# Altium schematic sheet Power.SchDoc
size A4; SheetNumber: 2; SheetTotal: 6
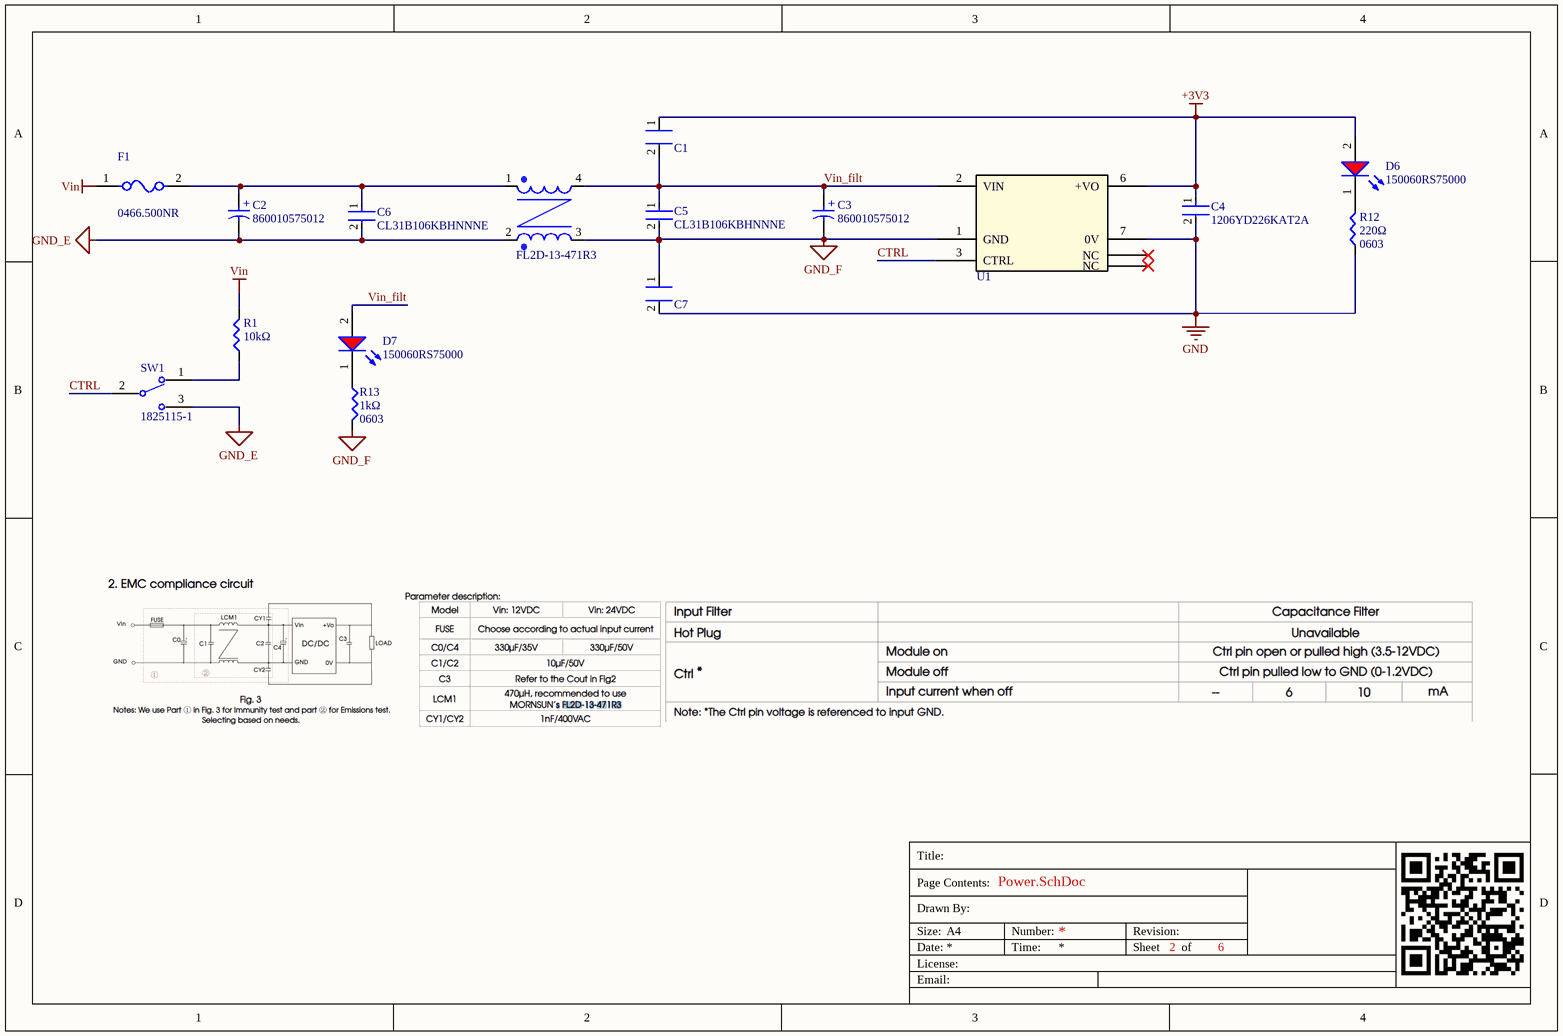
[diagram p0: Power.SchDoc]

## Parts
C1  1nf 400V AC 7.5mm Lead  [PCBComponent_1]  (value not drawn)
C2  860010575012  [WCAP-ATG8_D10H12.5]
C3  860010575012  [WCAP-ATG8_D10H12.5]
C4  1206YD226KAT2A  [FP-1206-L_3_2_0_2-W_1_6_0-IPC_A]
C5  CL31B106KBHNNNE  [FP-CL31B106KBHNNNE-IPC_A]
C6  CL31B106KBHNNNE  [FP-CL31B106KBHNNNE-IPC_A]
C7  1nf 400V AC 7.5mm Lead  [PCBComponent_1]  (value not drawn)
D6  150060RS75000  [WL-SMCW_0603_150060xx75000]
D7  150060RS75000  [WL-SMCW_0603_150060xx75000]
F1  0466.500NR  [FP-0466-MFG]
FL2D-13-471R3  EMC Filte  [FL2D-13-471R3]  (value not drawn)
R1  value 10kΩ  [0603-smd]  (hidden comment: 0603_10K)
R12  value 220Ω  Package: 0603  [0603-smd]  (hidden comment: 0603_220R)
R13  value 1kΩ  Package: 0603  [0603-smd]  (hidden comment: 0603_1K)
SW1  1825115-1  [FP-1825115-1-MFG]
U1  DC DC CONVERTER 3.3V 6W  [VRB_S-6WR3_MNS]  (value not drawn)

## Nets
+3V3: C1.1 C4.1 D6.2(A) U1.6(+VO)
GND: C4.2 C7.2 R12.1 U1.7(0V)
GND_E: C2.2(N) C6.2 FL2D-13-471R3.2 SW1.3
GND_F: C3.2(N) C5.2 C7.1 FL2D-13-471R3.3 R13.2 U1.1(GND)
Vin: F1.1 R1.2
CTRL: SW1.2 U1.3(CTRL)
Vin_filt: C1.2 C3.1(P) C5.1 D7.2(A) FL2D-13-471R3.4 U1.2(VIN)
NetC2_1: C2.1(P) C6.1 F1.2 FL2D-13-471R3.1
NetD6_1: D6.1(K) R12.2
NetD7_1: D7.1(K) R13.1
NetR1_1: R1.1 SW1.1

Not connected (* = marked no-connect by the designer): U1 5(NC)* 8(NC)*

## Notes on the sheet
- Title:
- Drawn By:
- Page Contents:
- Size:
- Date:
- License:
- Email:
- A4
- Number:
- Time:
- Revision:
- Sheet
- of
- (in symbol CMP-03913-54007241-1) +

## Library data of the parts
C1 C7 = C717U102MYVDBA7317: Suppression Cap, 1000Pf, Class X1/ Y2 Rohs Compliant: Yes |Kemet C717U102MYVDBA7317; Manufacturer: KEMET; Supplier 1: Mouser; Manufacturer Part Number: C717U102MYVDBA7317; RoHS: Yes; Category: Ceramic Capacitors; Stock 1: 1838; Pricing 1: 1=0,72, 10=0,387, 50=0,387, 100=0,25, 1000=0,223, 10000=0,18 (USD); RoHS Compliant: Yes; Supplier Part Number 1: 80-C717U102MYVDB7317; ComponentLink1Description: Datasheet; ComponentLink1URL: https://content.kemet.com/datasheets/KEM_C1103_KJY.pdf
C2 C3 = CMP-03913-54007241-1: 860010575012 WCAP-ATG8 Aluminum Electrolytic Capacitors; Ripple Current: 528mA; Voltage Rating: 35V; Capacitance: 330µF; Pitch: 5mm; Tolerance: 20%; Leakage Current: 115.5µA; Life (Hours): 2000hours; Case/Package: Radial; Max Operating Temperature: 85°C; REACH SVHC: Unknown; Min Operating Temperature: -40°C; NexarPartId: 54007241; Lead Pitch: 5mm; RoHS: Non-Compliant; Voltage Rating (DC): 35V; Diameter: 10mm; Height: 12.5mm; Length: 12.5mm
C4 = CMP-1037-04992-2: General Purpose Ceramic Capacitor, 1206, 22uF, 10%, X5R, 15%, 16V; REACH SVHC: No SVHC; Height: 0.07mm; Lead Free: Lead Free; Voltage Rating: 16V; Width: 0.063inch; Voltage Rating (DC): 16V; Mount: Surface Mount; Capacitance: 22uF; Case Code (Imperial): 1206; Package Quantity: 1; Radiation Hardening: No; Packaging: Tape and Reel; Number of Pins: 2; Construction: Flat; Max Operating Temperature: 85°C; Depth: 1.6mm; Case Code (Metric): 3216; Thickness: 0.07inch; Min Operating Temperature: -55°C; Contact Plating: Tin; Dielectric: X5R; Case/Package: 1206; Series: -; Termination: SMD/SMT; Length: 3.2mm; RoHS Compliant: Yes; Tolerance: 10%
C5 C6 = CMP-2000-07530-2: CAP CER 10UF 50V X7R 1206; Manufacturer: Samsung; Tolerance: 10%; Material: Ceramic; Temperature Coefficient: 15%; Temperature Characteristic: X7R; Digikey Description: CAP CER 10UF 50V X7R 1206; Device Class L1: Passive Components; Value: 10uF; Lead Free: Yes; Device Class L3: Ceramic Capacitors; Octopart: https://octopart.com/cl31b106kbhnnne-samsung-30507377; ComponentLink2URL: http://www.samsungsem.com/global/front/downloadcms.do?path=%2F%2Fglobal%2F%2Fsupport%2F%2Fproduct-search%2F%2Fmlcc%2F%2F__icsFiles%2F%2Fafieldfile%2F%2F2019%2F%2F06%2F%2F18&fileName=CL31B106KBHNNNE-19.pdf; Voltage Rating: 50V; Temperature Range Low: -55°C; RoHS: TRUE; Temperature: -55°C to +125°C; Category: Cap; ComponentLink2Description: Datasheet; Manufacturer Part Number: CL31B106KBHNNNE; Automotive: No; Device Class L2: Capacitors; Capacitance: 10uF; Height: 1.8mm; Temperature Range High: +125°C; Package: CL31B106KBHNNNE
D6 D7 = CMP-1426-00001-3: NexarPartId: 29717776; Color: Red; Power Dissipation: 72mW; Max Reverse Voltage (DC): 5V; Peak Wavelength: 630nm; Viewing Angle: 140°; Forward Voltage: 2V; Luminous Intensity: 250mcd; Forward Current: 100mA; Dominant Wavelength: 625nm; Lens Style: Clear, Rectangular; Max Junction Temperature (Tj): 95°C; Test Current: 20mA; Mount: Surface Mount; Packaging: Tape and Reel; Case Code (Metric): 1608; Max Operating Temperature: 85°C; Case Code (Imperial): 0603; REACH SVHC: Unknown; Width: 800µm; Length: 1.6mm; Reverse Voltage: 5V; Height: 700µm; Case/Package: 0603; RoHS: Compliant; Wavelength: 625nm; Min Operating Temperature: -40°C
F1 = CMP-08605-000018-1: FUSE BOARD MOUNT 500MA 63VAC/VDC; Manufacturer: Littelfuse Inc; Fuse Voltage Drop: 158.47mV; Voltage Rating: 63V; Fuse Interrupt Dc Current: 50A; Fuse Blow Speed: Fast; Fuse I2T: 0.006A2Sec; Resistance: 0.248Ω; Value: 0.248Ω; Fuse Current: 0.5A; Manufacturer Part Number: 0466.500NR; Digikey Description: FUSE BOARD MOUNT 500MA 63VAC/VDC; Device Class L2: Fuses; Max Fuse Dc Voltage: 63V; Mouser Description: SMD Fuse 0.5 A Fast-Blow, 466 1206; Octopart: https://octopart.com/0466.500nr-littelfuse-566004; Temperature Range High: +90°C; Lead Free: Yes; Fuse Interrupt Ac Current: 50A; RoHS: TRUE; Device Class L1: Circuit Protection; Height: 0.66mm; Automotive: No; Category: Fuse; Temperature: -55°C to +90°C; Package: 0466; Device Class L3: unset; ComponentLink2URL: https://www.littelfuse.com/~/media/electronics/datasheets/fuses/littelfuse_fuse_466_datasheet.pdf.pdf; Max Fuse Ac Voltage: 63V; ComponentLink2Description: Datasheet; Temperature Range Low: -55°C
FL2D-13-471R3 = FL2D-13-471R3: ComponentLink1Description: Datasheet; ComponentLink1URL: https://www.mornsun-power.com/html/pdf/FL2D-13-471R3.html
R1 = 0603_10K: Power: W; Package: 0603
R12 = 0603_220R: Power: W
R13 = 0603_1K: Power: W
SW1 = CMP-03405-000003-1: SWITCH SLIDE SPDT 250MA 125V; Manufacturer: TE Connectivity; Operating Force: 250gf; Electromechanical Life: 6000Cycles; Contact Resistance: 30mΩ; Voltage Rating Dc: 12V; Temperature Range High: +85°C; Manufacturer Part Number: 1825115-1; Temperature: -10°C to +85°C; Package: 1825115-1; Voltage Rating Ac: 125V; Category: Switch; Digikey Description: SWITCH SLIDE SPDT 250MA 125V; Throw Configuration: SPDT; RoHS: TRUE; Mount: Through Hole; Device Class L2: Switches; ComponentLink2Description: Datasheet; Automotive: No; ComponentLink2URL: https://www.te.com/usa-en/product-1825115-1.html?te_bu=Cor&te_type=other&te_campaign=oct_glo_cor-oct-global-oth-prtnr-fy19-oct-octo-buy-bom_sma-298_2&elqCampaignId=35216; Contact Current Rating: 250mA; Temperature Range Low: -10°C; Device Class L3: Slide Switches; Device Class L1: Electromechanical; Octopart: https://octopart.com/sls121pc04-te+connectivity-39426454; Lead Free: Yes
U1 = VRB1203S-6WR3: Isolated Module DC DC Converter 1 Output 3.3V 1.35A 9V - 18V Input; Mfr_Name: MORNSUN; Type: DC DC Converters; RefDes: RefDes; ComponentLink1Description: Datasheet; ComponentLink1URL: https://www.mornsun-power.com/html/pdf/VRB1203S-6WR3.html